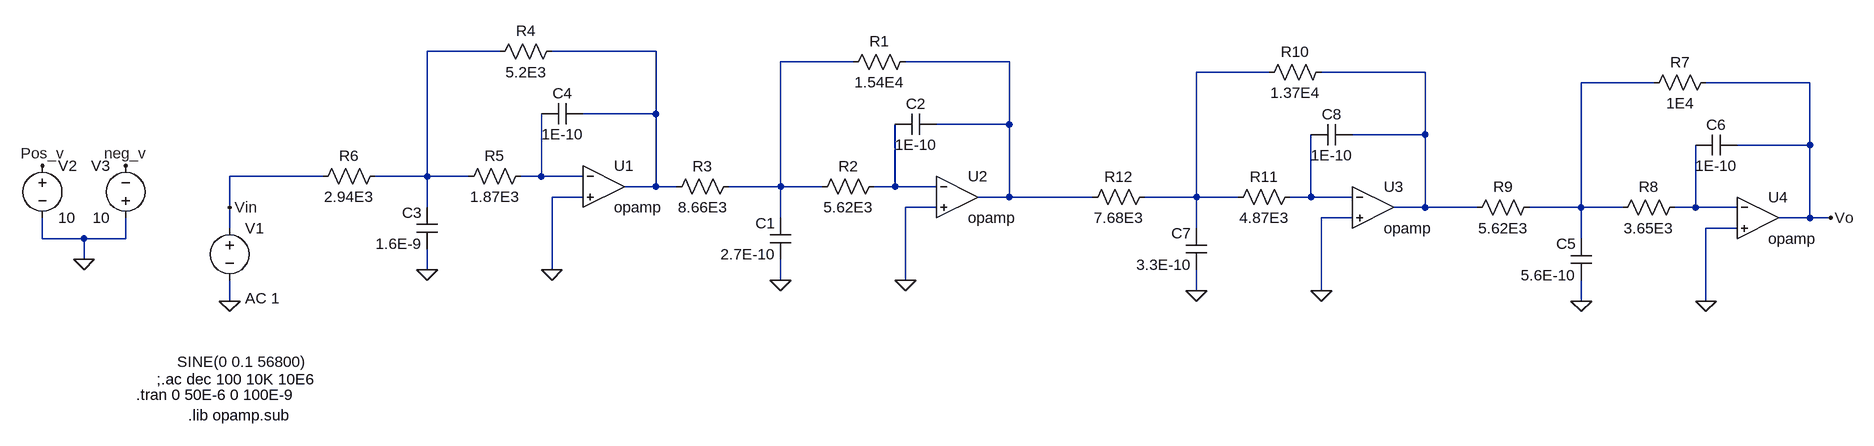
[diagram p0: schematic High order E96.asc]
High order E96.asc, the LTspice schematic file:
Version 4
SHEET 1 2464 680
WIRE 368 -752 256 -752
WIRE 608 -752 448 -752
WIRE 912 -736 800 -736
WIRE 1152 -736 992 -736
WIRE 1552 -720 1440 -720
WIRE 1792 -720 1632 -720
WIRE 2144 -704 2032 -704
WIRE 2384 -704 2224 -704
WIRE 608 -656 608 -752
WIRE 608 -656 496 -656
WIRE 1152 -640 1152 -736
WIRE 1152 -640 1040 -640
WIRE 1792 -624 1792 -720
WIRE 1792 -624 1680 -624
WIRE 2384 -608 2384 -704
WIRE 2384 -608 2272 -608
WIRE 96 -560 -48 -560
WIRE 256 -560 256 -752
WIRE 256 -560 176 -560
WIRE 320 -560 256 -560
WIRE 432 -560 432 -656
WIRE 432 -560 400 -560
WIRE 496 -560 432 -560
WIRE 608 -544 608 -656
WIRE 608 -544 560 -544
WIRE 640 -544 608 -544
WIRE 800 -544 800 -736
WIRE 800 -544 720 -544
WIRE 864 -544 800 -544
WIRE 976 -544 976 -640
WIRE 976 -544 944 -544
WIRE 1040 -544 976 -544
WIRE 496 -528 448 -528
WIRE 1152 -528 1152 -640
WIRE 1152 -528 1104 -528
WIRE 1280 -528 1152 -528
WIRE 1440 -528 1440 -720
WIRE 1440 -528 1360 -528
WIRE 1504 -528 1440 -528
WIRE 1616 -528 1616 -624
WIRE 1616 -528 1584 -528
WIRE 1680 -528 1616 -528
WIRE -48 -512 -48 -560
WIRE 256 -512 256 -560
WIRE 1040 -512 992 -512
WIRE 1792 -512 1792 -624
WIRE 1792 -512 1744 -512
WIRE 1872 -512 1792 -512
WIRE 2032 -512 2032 -704
WIRE 2032 -512 1952 -512
WIRE 2096 -512 2032 -512
WIRE 2208 -512 2208 -608
WIRE 2208 -512 2176 -512
WIRE 2272 -512 2208 -512
WIRE 800 -496 800 -544
WIRE 1680 -496 1632 -496
WIRE 2384 -496 2384 -608
WIRE 2384 -496 2336 -496
WIRE 2416 -496 2384 -496
WIRE -48 -480 -48 -512
WIRE 1440 -480 1440 -528
WIRE 2272 -480 2224 -480
WIRE -336 -464 -336 -496
WIRE -272 -464 -336 -464
WIRE -208 -464 -208 -496
WIRE -208 -464 -272 -464
WIRE 2032 -464 2032 -512
WIRE -272 -432 -272 -464
WIRE 256 -416 256 -448
WIRE 448 -416 448 -528
WIRE 800 -400 800 -432
WIRE 992 -400 992 -512
WIRE 1440 -384 1440 -416
WIRE 1632 -384 1632 -496
WIRE -48 -368 -48 -400
WIRE 2032 -368 2032 -400
WIRE 2224 -368 2224 -480
FLAG 992 -400 0
FLAG 800 -400 0
FLAG -48 -368 0
FLAG -336 -576 Pos_v
FLAG -208 -576 neg_v
FLAG -272 -432 0
FLAG 2416 -496 Vo
FLAG -48 -512 Vin
FLAG 448 -416 0
FLAG 256 -416 0
FLAG 2224 -368 0
FLAG 2032 -368 0
FLAG 1632 -384 0
FLAG 1440 -384 0
SYMBOL res 1008 -752 R90
WINDOW 0 0 56 VBottom 2
WINDOW 3 32 56 VTop 2
SYMATTR InstName R1
SYMATTR Value 1.54E4
SYMBOL res 960 -560 R90
WINDOW 0 0 56 VBottom 2
WINDOW 3 32 56 VTop 2
SYMATTR InstName R2
SYMATTR Value 5.62E3
SYMBOL res 736 -560 R90
WINDOW 0 0 56 VBottom 2
WINDOW 3 32 56 VTop 2
SYMATTR InstName R3
SYMATTR Value 8.66E3
SYMBOL cap 816 -432 R180
WINDOW 0 24 56 Left 2
WINDOW 3 24 8 Left 2
SYMATTR InstName C1
SYMATTR Value 2.7E-10
SYMBOL cap 976 -624 R270
WINDOW 0 32 32 VTop 2
WINDOW 3 0 32 VBottom 2
SYMATTR InstName C2
SYMATTR Value 1E-10
SYMBOL voltage -48 -496 R0
WINDOW 123 24 124 Left 2
WINDOW 39 0 0 Left 0
WINDOW 3 -81 221 Left 2
SYMATTR Value2 AC 1
SYMATTR Value SINE(0 0.1 56800)
SYMATTR InstName V1
SYMBOL voltage -336 -592 R0
WINDOW 123 0 0 Left 0
WINDOW 39 0 0 Left 0
SYMATTR InstName V2
SYMATTR Value 10
SYMBOL voltage -208 -480 R180
WINDOW 0 24 96 Left 2
WINDOW 3 24 16 Left 2
SYMATTR InstName V3
SYMATTR Value 10
SYMBOL res 464 -768 R90
WINDOW 0 0 56 VBottom 2
WINDOW 3 32 56 VTop 2
SYMATTR InstName R4
SYMATTR Value 5.2E3
SYMBOL res 416 -576 R90
WINDOW 0 0 56 VBottom 2
WINDOW 3 32 56 VTop 2
SYMATTR InstName R5
SYMATTR Value 1.87E3
SYMBOL res 192 -576 R90
WINDOW 0 0 56 VBottom 2
WINDOW 3 32 56 VTop 2
SYMATTR InstName R6
SYMATTR Value 2.94E3
SYMBOL cap 272 -448 R180
WINDOW 0 24 56 Left 2
WINDOW 3 24 8 Left 2
SYMATTR InstName C3
SYMATTR Value 1.6E-9
SYMBOL cap 432 -640 R270
WINDOW 0 32 32 VTop 2
WINDOW 3 0 32 VBottom 2
SYMATTR InstName C4
SYMATTR Value 1E-10
SYMBOL res 2240 -720 R90
WINDOW 0 0 56 VBottom 2
WINDOW 3 32 56 VTop 2
SYMATTR InstName R7
SYMATTR Value 1E4
SYMBOL res 2192 -528 R90
WINDOW 0 0 56 VBottom 2
WINDOW 3 32 56 VTop 2
SYMATTR InstName R8
SYMATTR Value 3.65E3
SYMBOL res 1968 -528 R90
WINDOW 0 0 56 VBottom 2
WINDOW 3 32 56 VTop 2
SYMATTR InstName R9
SYMATTR Value 5.62E3
SYMBOL cap 2048 -400 R180
WINDOW 0 24 56 Left 2
WINDOW 3 24 8 Left 2
SYMATTR InstName C5
SYMATTR Value 5.6E-10
SYMBOL cap 2208 -592 R270
WINDOW 0 32 32 VTop 2
WINDOW 3 0 32 VBottom 2
SYMATTR InstName C6
SYMATTR Value 1E-10
SYMBOL res 1648 -736 R90
WINDOW 0 0 56 VBottom 2
WINDOW 3 32 56 VTop 2
SYMATTR InstName R10
SYMATTR Value 1.37E4
SYMBOL res 1600 -544 R90
WINDOW 0 0 56 VBottom 2
WINDOW 3 32 56 VTop 2
SYMATTR InstName R11
SYMATTR Value 4.87E3
SYMBOL res 1376 -544 R90
WINDOW 0 0 56 VBottom 2
WINDOW 3 32 56 VTop 2
SYMATTR InstName R12
SYMATTR Value 7.68E3
SYMBOL cap 1456 -416 R180
WINDOW 0 24 56 Left 2
WINDOW 3 24 8 Left 2
SYMATTR InstName C7
SYMATTR Value 3.3E-10
SYMBOL cap 1616 -608 R270
WINDOW 0 32 32 VTop 2
WINDOW 3 0 32 VBottom 2
SYMATTR InstName C8
SYMATTR Value 1E-10
SYMBOL Opamps\\opamp 528 -608 R0
SYMATTR InstName U1
SYMBOL Opamps\\opamp 1072 -592 R0
SYMATTR InstName U2
SYMBOL Opamps\\opamp 1712 -576 R0
SYMATTR InstName U3
SYMBOL Opamps\\opamp 2304 -560 R0
SYMATTR InstName U4
TEXT -160 -248 Left 2 !;.ac dec 100 10K 10E6
TEXT -192 -224 Left 2 !.tran 0 50E-6 0 100E-9
TEXT -112 -192 Left 2 !.lib opamp.sub

The netlist it stands for:
* High order E96.asc
R1 N004 N003 1.54E4
R2 N009 N003 5.62E3
R3 N003 N002 8.66E3
C1 0 N003 2.7E-10
C2 N009 N004 1E-10
V1 Vin 0 SINE(0 0.1 56800) AC 1
V2 Pos_v 0 10
V3 0 neg_v 10
R4 N002 N001 5.2E3
R5 N008 N001 1.87E3
R6 N001 Vin 2.94E3
C3 0 N001 1.6E-9
C4 N008 N002 1E-10
R7 Vo N007 1E4
R8 N011 N007 3.65E3
R9 N007 N006 5.62E3
C5 0 N007 5.6E-10
C6 N011 Vo 1E-10
R10 N006 N005 1.37E4
R11 N010 N005 4.87E3
R12 N005 N004 7.68E3
C7 0 N005 3.3E-10
C8 N010 N006 1E-10
XU1 N008 0 N002 opamp Aol=100K GBW=10Meg  ; pins invin noninvin out
XU2 N009 0 N004 opamp Aol=100K GBW=10Meg  ; pins invin noninvin out
XU3 N010 0 N006 opamp Aol=100K GBW=10Meg  ; pins invin noninvin out
XU4 N011 0 Vo opamp Aol=100K GBW=10Meg  ; pins invin noninvin out
;.ac dec 100 10K 10E6
.tran 0 50E-6 0 100E-9
.lib opamp.sub
.backanno
.end

* Results of the author's LTspice run, read from the files saved beside the schematic
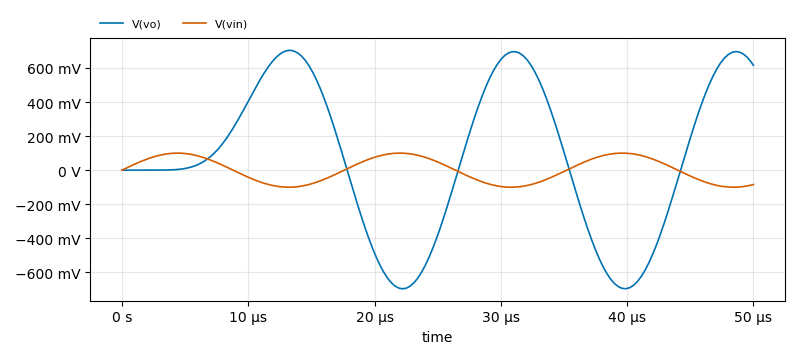
[diagram p1: Transient Analysis of High order E96.asc, plotted from the saved traces]
* Transient Analysis, 1 run:
*   V(vo): min -696.1 mV, max 703 mV, average 74.17 mV, rms 459.7 mV, last 615.1 mV
*   V(vin): min -100 mV, max 100 mV, average 2.604 mV, rms 71.6 mV, last -84.43 mV